# EAGLE design board (EAGLE 9.6.1)
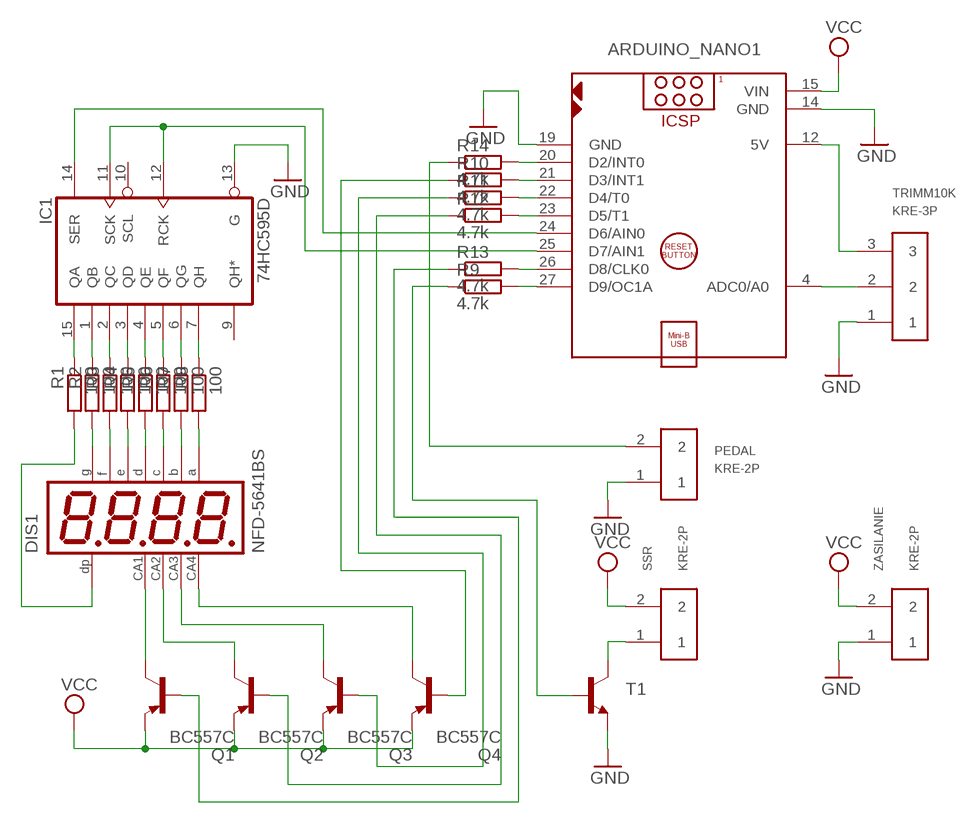
[diagram p0: schematic, sheet 1]

## Parts
ARDUINO_NANO1  ARDUINO_NANO  [ARDUINO_NANO]
DIS1  NFD-5641BS  [NFD-5641]
IC1  74HC595D  [SO16]
PEDAL  KRE-2P  [KRE-2P]
Q1  BC557C  [TO92-EBC]
Q2  BC557C  [TO92-EBC]
Q3  BC557C  [TO92-EBC]
Q4  BC557C  [TO92-EBC]
R1  100  R-EU_0207/10  [0207/10]
R2  100  R-EU_0207/10  [0207/10]
R3  100  R-EU_0207/10  [0207/10]
R4  100  R-EU_0207/10  [0207/10]
R5  100  R-EU_0207/10  [0207/10]
R6  100  R-EU_0207/10  [0207/10]
R7  100  R-EU_0207/10  [0207/10]
R8  100  R-EU_0207/10  [0207/10]
R9  4.7k  R-EU_0207/10  [0207/10]
R10  4.7k  R-EU_0207/10  [0207/10]
R11  4.7k  R-EU_0207/10  [0207/10]
R12  4.7k  R-EU_0207/10  [0207/10]
R13  4.7k  R-EU_0207/10  [0207/10]
R14  4.7k  R-EU_0207/10  [0207/10]
SSR  KRE-2P  [KRE-2P]
T1  BC337-NPN-TO92-CBE  [TO92-CBE]
TRIMM10K  KRE-3P  [KRE-3P]
ZASILANIE  KRE-2P  [KRE-2P]

## Nets
GND: ARDUINO_NANO1.14(GND) ARDUINO_NANO1.19(GND) IC1.13(G) PEDAL.1 T1.E TRIMM10K.1 ZASILANIE.1
N$1: IC1.15(QA) R1.1
N$2: IC1.1(QB) R2.1
N$3: IC1.2(QC) R3.1
N$4: IC1.3(QD) R4.1
N$5: IC1.4(QE) R5.1
N$6: IC1.5(QF) R6.1
N$7: IC1.6(QG) R7.1
N$8: IC1.7(QH) R8.1
N$9: DIS1.P$5 R2.2
N$10: DIS1.P$10 R3.2
N$11: DIS1.P$1 R4.2
N$12: DIS1.P$2 R5.2
N$13: DIS1.P$4 R6.2
N$14: DIS1.P$7 R7.2
N$15: DIS1.P$11 R8.2
N$16: DIS1.P$3 R1.2
N$17: DIS1.P$12 Q1.C
N$18: DIS1.P$9 Q2.C
N$19: DIS1.P$8 Q3.C
N$20: DIS1.P$6 Q4.C
N$21: ARDUINO_NANO1.26(D8/CLK0) R13.2
N$22: ARDUINO_NANO1.23(D5/T1) R12.2
N$23: ARDUINO_NANO1.22(D4/T0) R11.2
N$24: ARDUINO_NANO1.21(D3/INT1) R10.2
N$25: Q4.B R10.1
N$26: ARDUINO_NANO1.20(D2/INT0) R14.2
N$27: Q3.B R11.1
N$28: R9.1 T1.B
N$29: Q2.B R12.1
N$30: Q1.B R13.1
N$31: ARDUINO_NANO1.24(D6/AIN0) IC1.14(SER)
N$32: ARDUINO_NANO1.25(D7/AIN1) IC1.11(SCK) IC1.12(RCK)
N$33: SSR.1 T1.C
N$34: ARDUINO_NANO1.27(D9/OC1A) R9.2
N$35: ARDUINO_NANO1.12(5V) TRIMM10K.3
N$36: PEDAL.2 R14.1
N$37: ARDUINO_NANO1.4(ADC0/A0) TRIMM10K.2
VCC: ARDUINO_NANO1.15(VIN) Q1.E Q2.E Q3.E Q4.E SSR.2 ZASILANIE.2
Unconnected: IC1.9(QH*) IC1.10(SCL)

## Power pins joined to a net without a drawn wire
GND: IC1.8(GND)
VCC: IC1.16(VCC)

## Library data of the parts
ARDUINO_NANO1 = ArduinoNanoMOD:ARDUINO_NANO: Arduino Nano V3.0 Module Overview: The Arduino Nano is a small, complete, and breadboard-friendly board based on the ATmega328 (Arduino Nano 3.x) or ATmega168 (Arduino Nano 2.x). It has more or less the same functionality of the Arduino Duemilanove, but in a different package. It lacks only a DC power jack, and works with a Mini-B USB cable instead of a standard one. The Nano was designed and is being produced by Gravitech <http://www.gravitech.us/arna30wiatp.html>. General specifications: Item Value Microcontroller Atmel ATmega168 or ATmega328 Operating Voltage (logic level) 5 V Input Voltage (recommended) 7-12 V Input Voltage (limits) 6-20 V Digital I/O Pins 14 (of which 6 provide PWM output) Analog Input Pins 8 DC Current per I/O Pin 40 mA Flash Memory 16 KB (ATmega168) or 32 KB (ATmega328) of which 2 KB used by bootloader SRAM 1 KB (ATmega168) or 2 KB (ATmega328) EEPROM 512 bytes (ATmega168) or 1 KB (ATmega328) Clock Speed 16 MHz Dimensions (Inches) 0.73" x 1.70" Dimensions (mm) 18mm x 45mm Overall height About 9 mm (not including pins) Weigth 5 g Power: The Arduino Nano can be powered via the Mini-B USB connection, 6-20V unregulated external power supply (pin 30), or 5V regulated external power supply (pin 27). The power source is automatically selected to the highest voltage source. Memory: The ATmega168 has 16 KB of flash memory for storing code (of which 2 KB is used for the bootloader); the ATmega328 has 32 KB, (also with 2 KB used for the bootloader). The ATmega168 has 1 KB of SRAM and 512 bytes of EEPROM (which can be read and written with the EEPROM library); the ATmega328 has 2 KB of SRAM and 1 KB of EEPROM. Input and Output: Each of the 14 digital pins on the Nano can be used as an input or output, using pinMode(), digitalWrite(), and digitalRead() functions. They operate at 5 volts. Each pin can provide or receive a maximum of 40 mA and has an internal pull-up resistor (disconnected by default) of 20-50 kOhms. In addition, some pins have specialized functions. Visit Arduino - ArduinoBoardNano <https://www.arduino.cc/en/Main/ArduinoBoardNano>
DIS1 = display-nfd:NFD-5641BS: Four Digit 0.56" CA Seven-Segment LED Display Futurlec part number: 7FR5641BS Created by RobG
IC1 = 74xx-eu:74*595: 8-bit SHIFT REGISTER, output latch
PEDAL SSR ZASILANIE = kre:KRE-2P: KRE Conector 2P
Q1-Q4 = transistor-pnp:BC557*: PNP Transistror
R1-R14 = rcl:R-EU_: RESISTOR, European symbol; SPICEPREFIX: R
T1 = transistor:*-NPN-: NPN Transistror BF959 corrected 2008.03.06
TRIMM10K = kre:KRE-3P: KRE Conector 3P

## Board
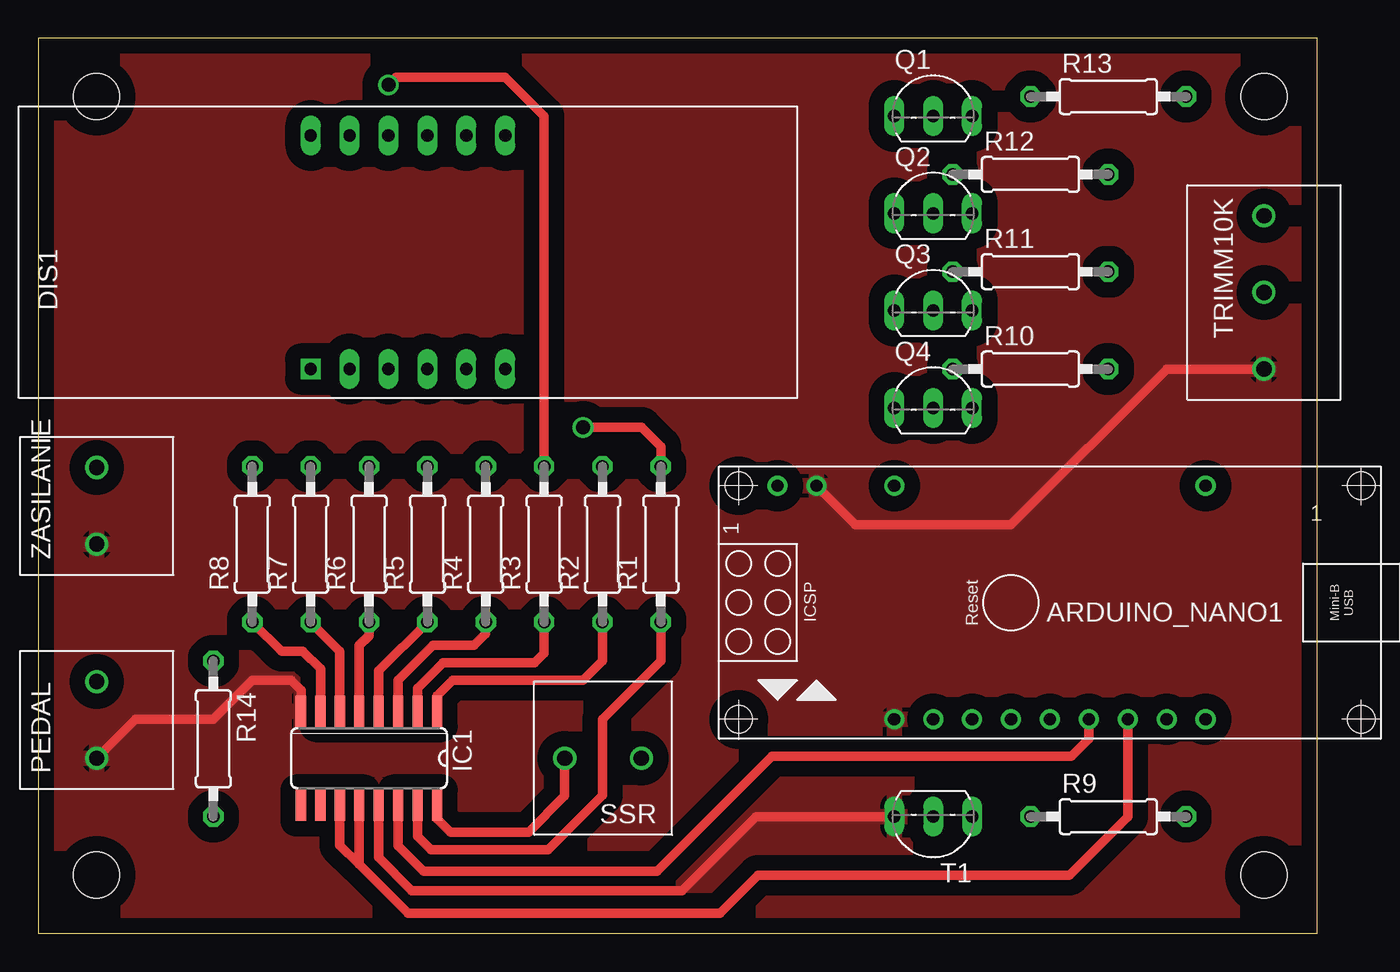
[diagram p1: board, top side]
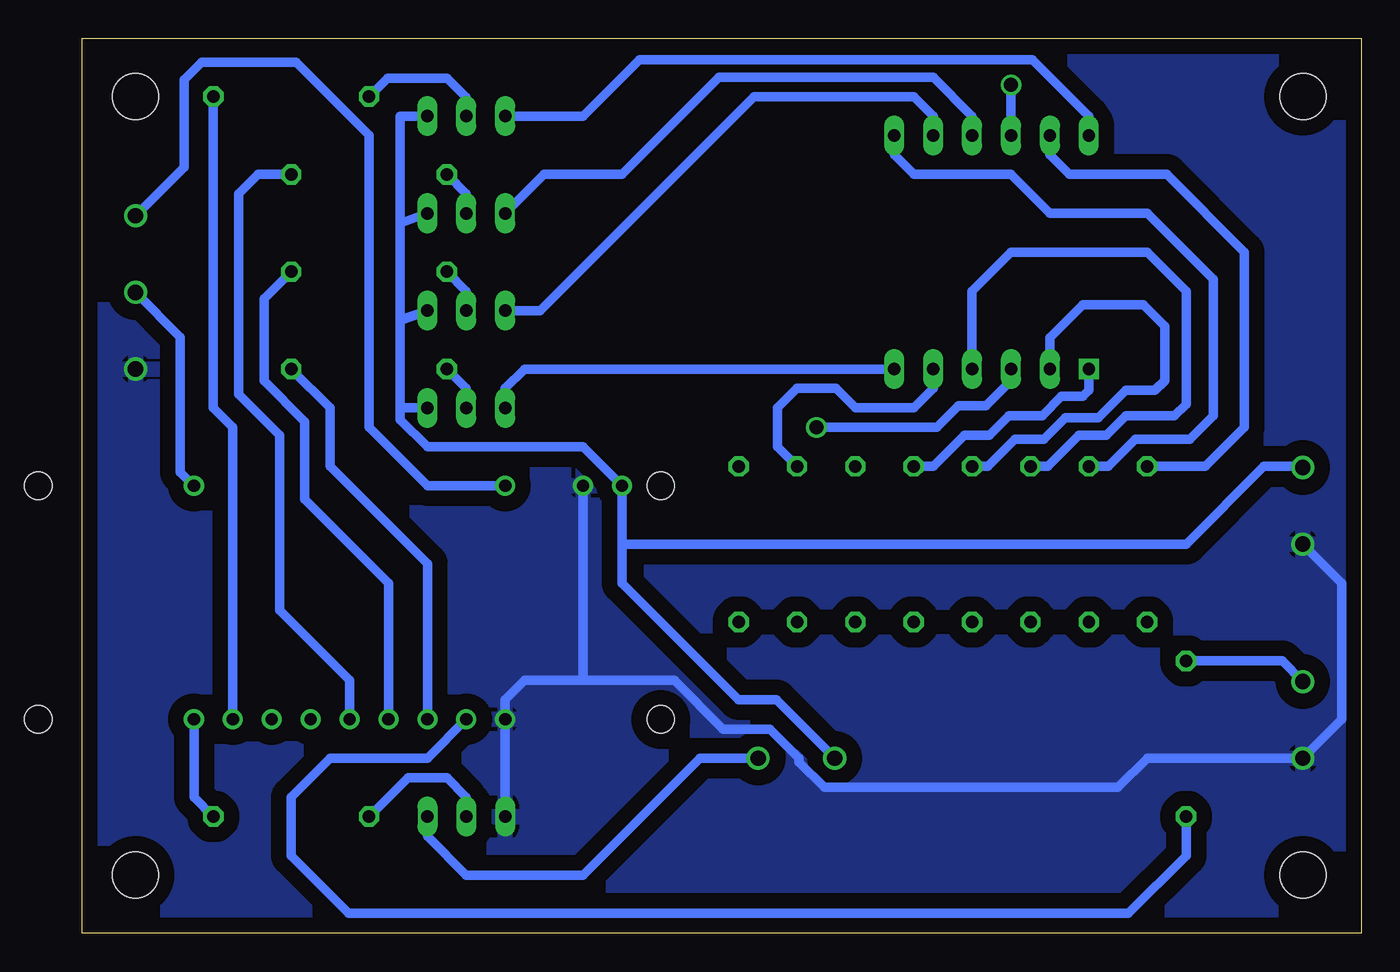
[diagram p2: board, bottom side, seen from below]

Size 83.49 x 58.41 mm. Coordinates in mm from the lower left corner, seen from the top.
Outline: 0,0 83.49,0 83.49,58.41 0,58.41 0,0
Copper layers (1*16): Top 0.035mm / dielectric 1.5mm / Bottom 0.035mm
Design rules "default": minimum track width 6mil, minimum drill 0.35mm, track to track 6mil, track to pad 6mil, pad to pad 6mil, via to via 6mil, smd to smd 6mil, copper to edge 40mil, drill to drill 6mil, minimum pad ring 10mil, minimum via ring 8mil, stop-mask expansion 4mil, vias tented up to drill 0mil, thermal gap 10mil
Holes 3 mm at 3.81,3.81 80.01,3.81 3.81,54.61 80.01,54.61

### Footprints (pad centres in the part's own frame; a part is rotated, then mirrored left to right if it is on the bottom)
ARDUINO_NANO = drill 0.8: 4 -12.7,-7.62; 12 7.62,-7.62; 14 12.7,-7.62; 15 15.24,-7.62; 19 7.62,7.62; 20 5.08,7.62; 21 2.54,7.62; 22 0,7.62; 23 -2.54,7.62; 24 -5.08,7.62; 25 -7.62,7.62; 26 -10.16,7.62; 27 -12.7,7.62 | hole 1.778: -22.86,-7.62; -22.86,7.62; 17.78,7.62; 17.78,-7.62
NFD-5641 = drill 0.8 square: P$1 -6.35,-7.62 | drill 0.8 long: P$2 -3.81,-7.62; P$3 -1.27,-7.62; P$4 1.27,-7.62; P$5 3.81,-7.62; P$6 6.35,-7.62; P$7 6.35,7.62; P$8 3.81,7.62; P$9 1.27,7.62; P$10 -1.27,7.62; P$11 -3.81,7.62; P$12 -6.35,7.62
SO16 = smd 0.66 x 2.032: 1 -4.445,-3.073; 2 -3.175,-3.073; 3 -1.905,-3.073; 4 -0.635,-3.073; 5 0.635,-3.073; 6 1.905,-3.073; 7 3.175,-3.073; 8 4.445,-3.073; 9 4.445,3.073; 10 3.175,3.073; 11 1.905,3.073; 12 0.635,3.073; 13 -0.635,3.073; 14 -1.905,3.073; 15 -3.175,3.073; 16 -4.445,3.073
KRE-2P = drill 1: 1 -2.54,0; 2 2.46,0
TO92-EBC = drill 0.813 long: B 0,-1.27; C -2.54,-1.27; E 2.54,-1.27
0207/10 = drill 0.813 octagon: 1 -5.08,0; 2 5.08,0
TO92-CBE = drill 0.813 long: B 0,0; C -2.54,0; E 2.54,0
KRE-3P = drill 1: 1 -5.08,0; 2 -0.08,0; 3 4.92,0

### Placement (x,y rotation side)
ARDUINO_NANO1  63.5,21.59 180 top
DIS1  24.13,44.45 0 top
IC1  21.59,11.43 180 top
PEDAL  3.81,13.97 90 top
Q1  58.42,54.61 0 top
Q2  58.42,48.26 0 top
Q3  58.42,41.91 0 top
Q4  58.42,35.56 0 top
R1  40.64,25.4 90 top
R2  36.83,25.4 90 top
R3  33.02,25.4 90 top
R4  29.21,25.4 90 top
R5  25.4,25.4 90 top
R6  21.59,25.4 90 top
R7  17.78,25.4 90 top
R8  13.97,25.4 90 top
R9  69.85,7.62 0 top
R10  64.77,36.83 0 top
R11  64.77,43.18 0 top
R12  64.77,49.53 0 top
R13  69.85,54.61 0 top
R14  11.43,12.7 270 top
SSR  36.83,11.43 180 top
T1  58.42,7.62 180 top
TRIMM10K  80.01,41.91 90 top
ZASILANIE  3.81,27.94 90 top

### Tracks (layer width: path | path; a pad name or v marks a point on that pad's centre or on a via)
GND
  Top 0.61: IC1.13 22.23,4.95 24.38,2.79 42.04,2.79 46.86,7.62 T1.E | IC1.8 17.14,15.88 16.51,16.51 13.97,16.51 11.43,13.97 6.35,13.97 PEDAL.1 | ARDUINO_NANO1.14 53.34,26.67 63.5,26.67 73.66,36.83 TRIMM10K.1
  Bottom 0.61: T1.E ARDUINO_NANO1.19 55.88,15.24 54.61,16.51 50.8,16.51 | 50.8,16.51 44.83,16.51 41.66,13.34 38.61,13.34 36.7,11.43 36.7,11.18 35.05,9.53 15.88,9.53 13.97,11.43 PEDAL.1 1.27,13.97 1.27,22.86 ZASILANIE.1 | ARDUINO_NANO1.14 50.8,16.51
  pour Top (isolate 1.016): 0,58.42 83.82,58.42 83.82,0 0,0
  pour Bottom (isolate 1.016): 0,58.42 83.82,58.42 83.82,0 0,0
N$1
  Top 0.61: IC1.15 24.77,6.35 25.65,5.46 33.27,5.46 36.83,9.02 36.83,13.97 40.64,17.78 R1.1
N$2
  Top 0.61: R2.1 36.83,17.78 35.56,16.51 27.05,16.51 26.04,15.49 IC1.1
N$3
  Top 0.61: R3.1 33.02,18.29 32.38,17.65 26.42,17.65 24.77,16 IC1.2
N$4
  Top 0.61: R4.1 29.21,19.56 28.45,18.8 25.78,18.8 23.5,16.51 IC1.3
N$5
  Top 0.61: R5.1 22.23,17.14 IC1.4
N$6
  Top 0.61: R6.1 21.59,19.43 20.95,18.8 IC1.5
N$7
  Top 0.61: R7.1 19.68,18.41 IC1.6
N$8
  Top 0.61: R8.1 15.88,18.41 17.27,18.41 18.41,17.27 IC1.7
N$9
  Bottom 0.61: R2.2 38.1,31.75 38.1,34.29 36.83,35.56 34.29,35.56 33.02,34.29 29.21,34.29 27.94,35.56 DIS1.P$5
N$10  (via drill 0.9)
  Top 0.61: R3.2 33.02,53.34 30.48,55.88 23.37,55.88 v22.86,55.37
  Bottom 0.61: v22.86,55.37 DIS1.P$10
N$11
  Bottom 0.61: R4.2 27.94,30.48 25.91,32.51 24.26,32.51 22.99,33.78 20.83,33.78 19.56,35.05 18.16,35.05 17.78,35.43 DIS1.P$1
N$12
  Bottom 0.61: DIS1.P$2 20.32,38.86 18.16,41.02 14.22,41.02 12.83,39.62 12.83,36.07 13.46,35.43 15.37,35.43 17.14,33.66 19.3,33.66 20.7,32.26 22.61,32.26 24.38,30.48 R5.2
N$13
  Bottom 0.61: DIS1.P$4 25.4,41.91 22.86,44.45 13.97,44.45 11.43,41.91 11.43,34.54 12.19,33.78 15.37,33.78 16.64,32.51 18.41,32.51 20.45,30.48 R6.2
N$14
  Bottom 0.61: DIS1.P$7 30.48,50.8 29.21,49.53 22.86,49.53 20.32,46.99 13.97,46.99 9.65,42.67 9.65,33.78 11.18,32.26 14.73,32.26 16.51,30.48 R7.2
N$15
  Bottom 0.61: DIS1.P$11 20.32,50.8 19.05,49.53 12.7,49.53 7.62,44.45 7.62,33.02 10.16,30.48 R8.2
N$16  (via drill 0.9)
  Top 0.61: R1.2 40.64,31.75 39.37,33.02 v35.56,33.02
  Bottom 0.61: v35.56,33.02 27.69,33.02 26.29,34.42 24.51,34.42 22.86,36.07 DIS1.P$3
N$17
  Bottom 0.61: DIS1.P$12 17.78,53.34 21.46,57.02 47.12,57.02 50.8,53.34 Q1.C
N$18
  Bottom 0.61: Q2.C 53.34,49.53 48.26,49.53 41.91,55.88 27.94,55.88 25.4,53.34 DIS1.P$9
N$19
  Bottom 0.61: Q3.C 53.59,40.64 39.62,54.61 29.21,54.61 27.94,53.34 DIS1.P$8
N$20
  Bottom 0.61: DIS1.P$6 54.61,36.83 55.88,35.56 Q4.C
N$21
  Bottom 0.61: ARDUINO_NANO1.26 73.66,33.02 74.93,34.29 R13.2
N$22
  Bottom 0.61: ARDUINO_NANO1.23 66.04,16.51 70.61,21.08 70.61,32.51 73.28,35.18 73.28,48.26 72.01,49.53 R12.2
N$23
  Bottom 0.61: ARDUINO_NANO1.22 63.5,22.86 68.96,28.32 68.96,33.4 71.63,36.07 71.63,41.4 R11.2
N$24
  Bottom 0.61: ARDUINO_NANO1.21 60.96,24.13 67.31,30.48 67.31,34.29 R10.2
N$25
  Bottom 0.61: Q4.B 58.42,35.56 R10.1
N$26
  Bottom 0.61: ARDUINO_NANO1.20 60.96,11.43 67.31,11.43 69.85,8.89 69.85,5.08 66.09,1.32 15.19,1.32 11.43,5.08 R14.2
N$27
  Bottom 0.61: Q3.B 58.42,41.91 R11.1
N$28
  Bottom 0.61: R9.1 62.23,10.16 59.69,10.16 58.42,8.89 T1.B
N$29
  Bottom 0.61: Q2.B 58.42,48.26 R12.1
N$30
  Bottom 0.61: Q1.B 58.42,54.55 59.69,55.82 63.56,55.82 R13.1
N$31
  Top 0.61: IC1.14 23.5,5.71 25.15,4.06 40.39,4.06 47.88,11.56 67.44,11.56 68.58,12.7 ARDUINO_NANO1.24
N$32
  Top 0.61: IC1.12 20.95,4.5 | 20.95,4.5 24.13,1.32 44.5,1.32 46.99,3.81 67.31,3.81 71.12,7.62 ARDUINO_NANO1.25 | IC1.11 19.68,5.77 20.95,4.5
N$33
  Bottom 0.61: T1.C 60.96,6.35 58.42,3.81 50.8,3.81 43.18,11.43 SSR.1
N$34
  Bottom 0.61: R9.2 76.2,8.89 ARDUINO_NANO1.27
N$35
  Bottom 0.61: ARDUINO_NANO1.12 60.96,29.21 64.77,33.02 64.77,52.07 69.53,56.84 75.69,56.84 76.83,55.69 76.83,50.01 TRIMM10K.3
N$36
  Bottom 0.61: PEDAL.2 5.16,17.78 R14.1
N$37
  Bottom 0.61: ARDUINO_NANO1.4 77.09,30.1 77.09,38.91 TRIMM10K.2
VCC
  Top 0.61: SSR.2 34.37,8.97 32,6.6 26.92,6.6 26.04,7.49 IC1.16
  Bottom 0.61: SSR.2 38.18,15.24 40.64,15.24 48.26,22.86 48.26,25.4 | 48.26,25.4 ARDUINO_NANO1.15 50.8,31.75 60.96,31.75 62.74,33.53 62.74,34.29 | 62.74,34.29 62.74,40.01 | 48.26,25.4 11.43,25.4 6.35,30.48 3.89,30.48 ZASILANIE.2 | Q4.E 62.74,34.29 | 62.74,40.01 Q3.E | 62.74,40.01 62.74,46.35 | 62.74,46.35 62.74,53.34 Q1.E | 62.74,46.35 Q2.E